# EasyEDA Pro project hall_effect_breakout_2025-11-21.epro

# Schematic Schematic1
Board Name: Board1; Create Date: 2025-10-31; Page Name: P1; Project Name: hall_effect_block_interface; Schematic Name: Schematic1; Update Date: 2025-11-03; Company: EasyEDA.com; Page Size: A4; Version: V1.0
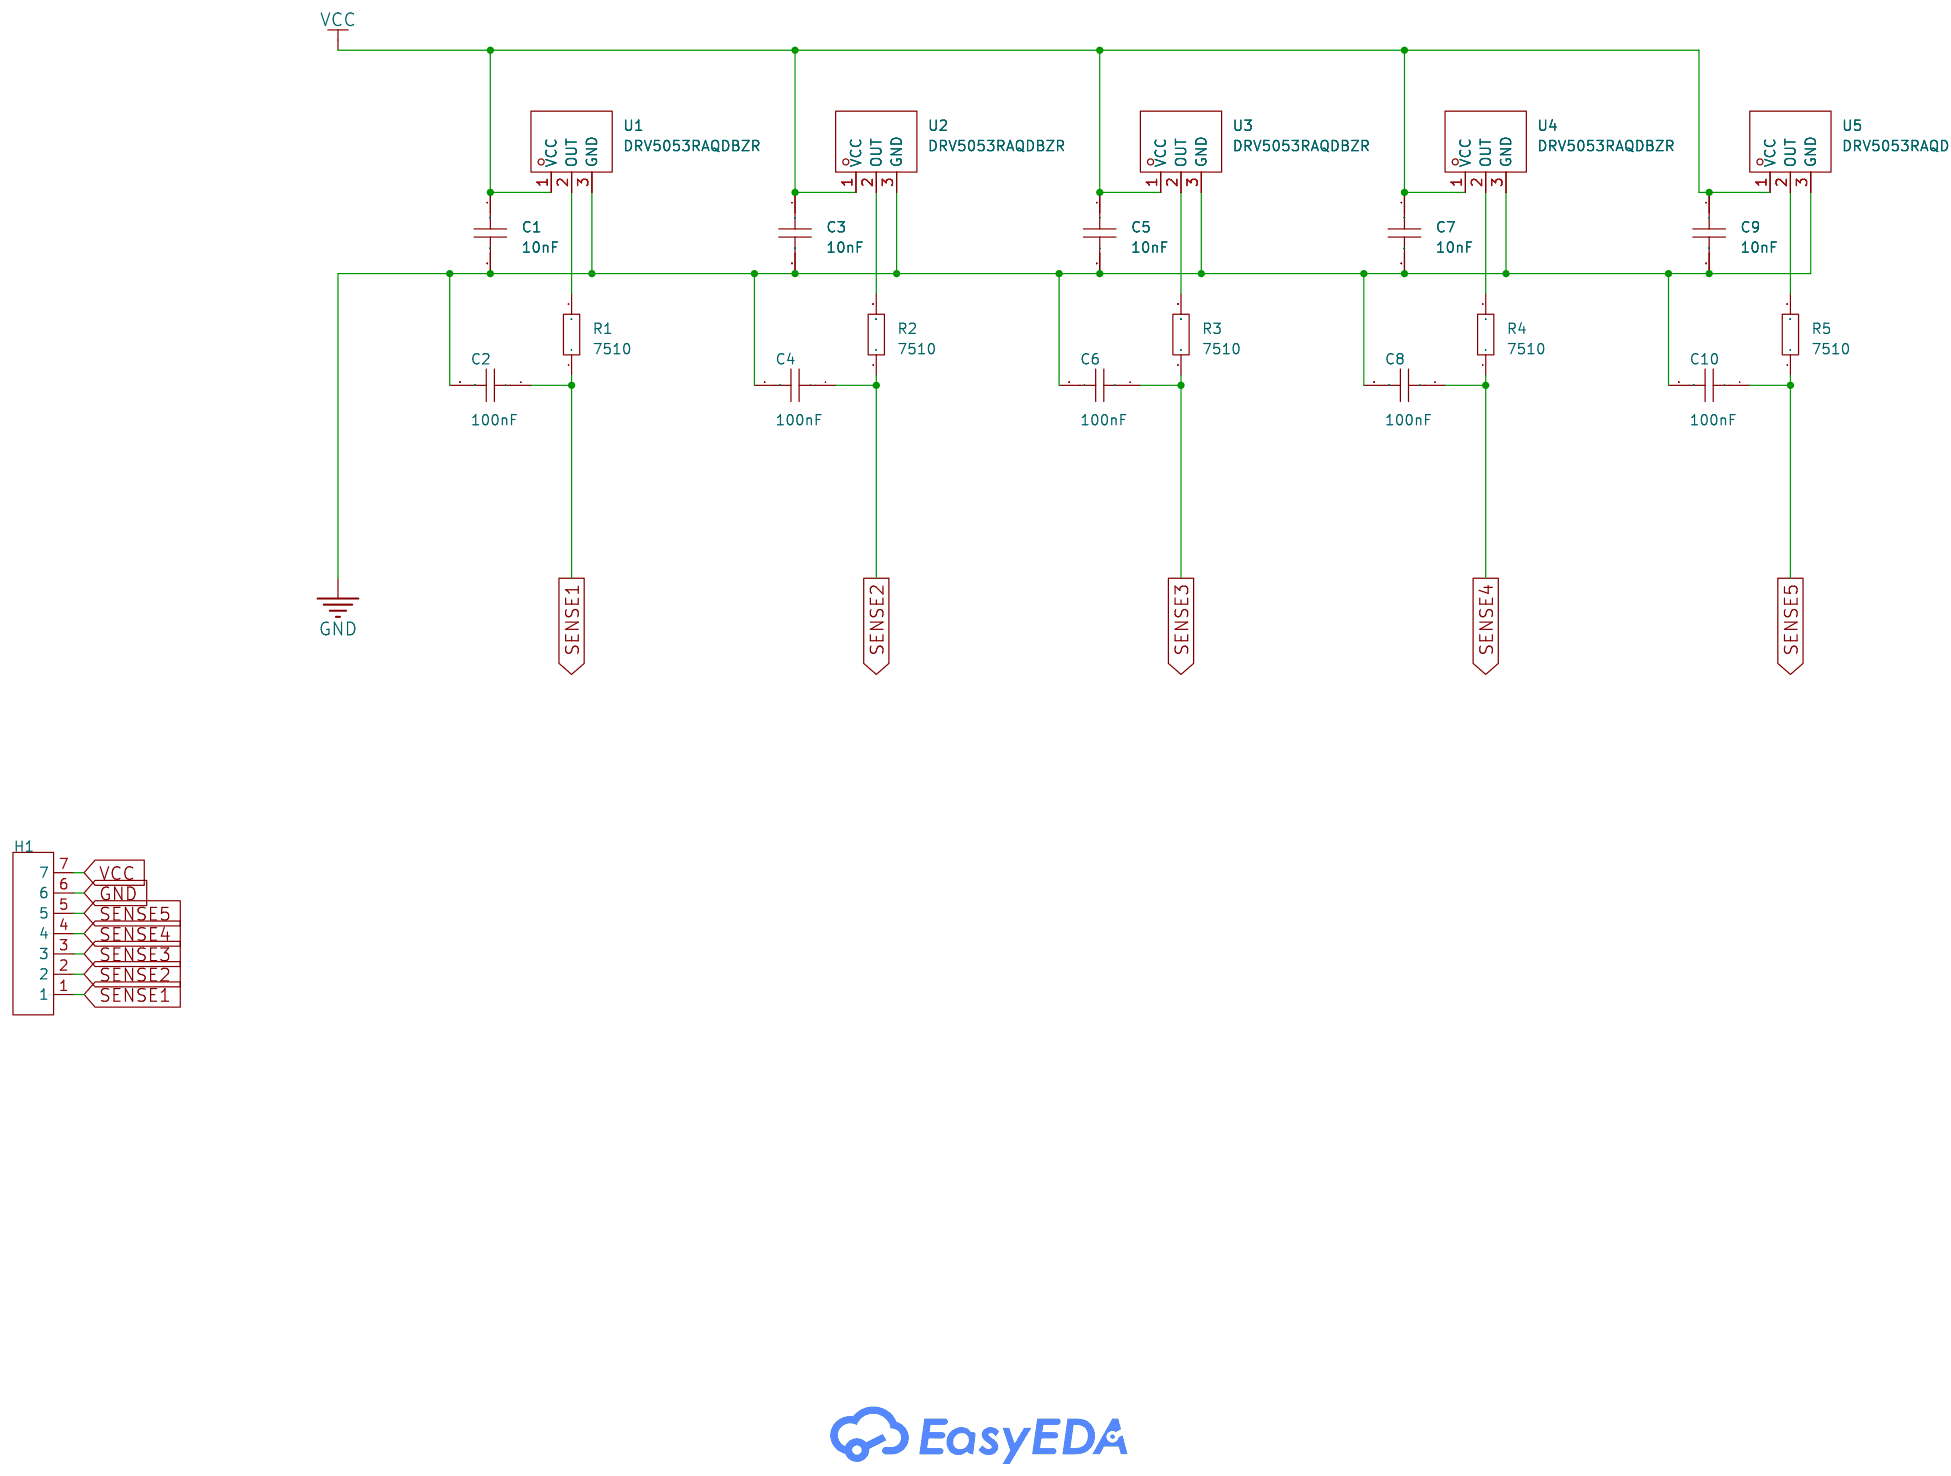
[diagram p0: schematic sheet]

## Parts
C1  10nF  [C0603]
C2  100nF  [C0603]
C3  10nF  [C0603]
C4  100nF  [C0603]
C5  10nF  [C0603]
C6  100nF  [C0603]
C7  10nF  [C0603]
C8  100nF  [C0603]
C9  10nF  [C0603]
C10  100nF  [C0603]
H1  PZ254V-11-07P  [HDR-TH_7P-P2.54-V-M]
R1  7510  [R0603]
R2  7510  [R0603]
R3  7510  [R0603]
R4  7510  [R0603]
R5  7510  [R0603]
U1  DRV5053RAQDBZR  [SOT-23-3_L2.9-W1.3-P0.95-LS2.4-BR]
U2  DRV5053RAQDBZR  [SOT-23-3_L2.9-W1.3-P0.95-LS2.4-BR]
U3  DRV5053RAQDBZR  [SOT-23-3_L2.9-W1.3-P0.95-LS2.4-BR]
U4  DRV5053RAQDBZR  [SOT-23-3_L2.9-W1.3-P0.95-LS2.4-BR]
U5  DRV5053RAQDBZR  [SOT-23-3_L2.9-W1.3-P0.95-LS2.4-BR]

## Library data of the parts
C1-C10 = CAP_0603: Supplier Footprint: 0603
H1 = PZ254V-11-07P: Pin Structure:1x7P Pitch:2.54mm Row Spacing:- Circluar Pins/Square Pins:Policy Mounting Type:Straight Number of Rows:Single Row Number of Pins:7P Current Rating:- Voltage Rating (Max):- Length of Mating Pin:6mm Insulation Height:2.5mm Length of End Connec; LCSC Part Name: 1x7P 间距:2.54mm 方针 直插; Supplier Part: C492406; Manufacturer: XFCN(兴飞); Supplier Footprint: 插件,P=2.54mm; JLCPCB Part Class: Extended Part; Datasheet: https://atta.szlcsc.com/upload/public/pdf/source/20200309/C492406_654C533EE691117E22DD9F76C114C2D9.pdf; Supplier: LCSC; Pin Structure: 1x7P; Pitch: 2.54mm; Circluar Pins/Square Pins: Policy; Mounting Type: Straight; Number of Rows: Single Row; Number of Pins: 7P; Length of Mating Pin: 6mm; Insulation Height: 2.5mm; Length of End Connection Pin: 3mm; Contact Material: Brass; Operating Temperature: -40℃~+105℃; Color: Black
R1-R5 = Res_0603: Supplier Footprint: 0603
U1-U5 = DRV5053RAQDBZR: Type:Bipolar Voltage - Supply:2.5V~38V Voltage - Supply:2.5V~38V Output Current:300uA Operating Temperature:-40℃~+125℃ Operating Temperature:-40℃~+125℃ Operating Current:2.7mA Sample Frequency:20kHz; LCSC Part Name: 双极霍尔效应传感器; Supplier Part: C2654960; Manufacturer: TI(德州仪器); Supplier Footprint: SOT-23; JLCPCB Part Class: Extended Part; Datasheet: https://www.ti.com/cn/lit/gpn/drv5053; Supplier: LCSC; Type: Bipolar; Voltage - Supply: 2.5V~38V; Output Current: 300uA; Operating Temperature: -40℃~+125℃; Operating Current: 2.7mA; Sample Frequency: 20kHz

## Nets
GND: C1.2 C2.2 C3.2 C4.2 C5.2 C6.2 C7.2 C8.2 C9.2 C10.2 H1.6 U1.3(GND) U2.3(GND) U3.3(GND) U4.3(GND) U5.3(GND)
VCC: C1.1 C3.1 C5.1 C7.1 C9.1 H1.7 U1.1(VCC) U2.1(VCC) U3.1(VCC) U4.1(VCC) U5.1(VCC)
SENSE1: C2.1 H1.1 R1.1
SENSE2: C4.1 H1.2 R2.1
SENSE3: C6.1 H1.3 R3.1
SENSE4: C8.1 H1.4 R4.1
SENSE5: C10.1 H1.5 R5.1
$1N1911: R1.2 U1.2(OUT)
$1N2092: R2.2 U2.2(OUT)
$1N2255: R3.2 U3.2(OUT)
$1N2426: R4.2 U4.2(OUT)
$1N2605: R5.2 U5.2(OUT)

# Board PCB1
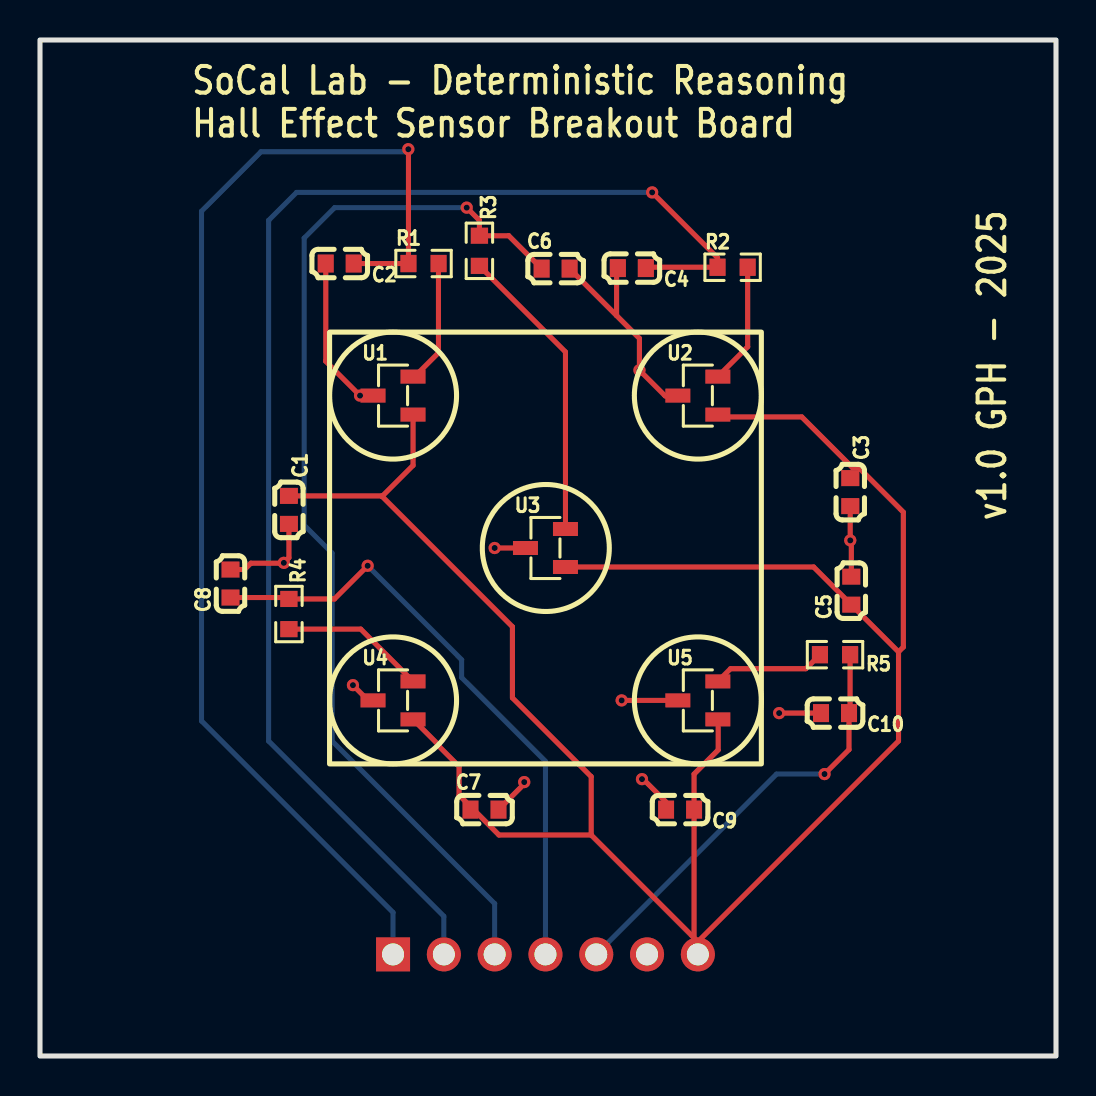
[diagram p1: board, top side]
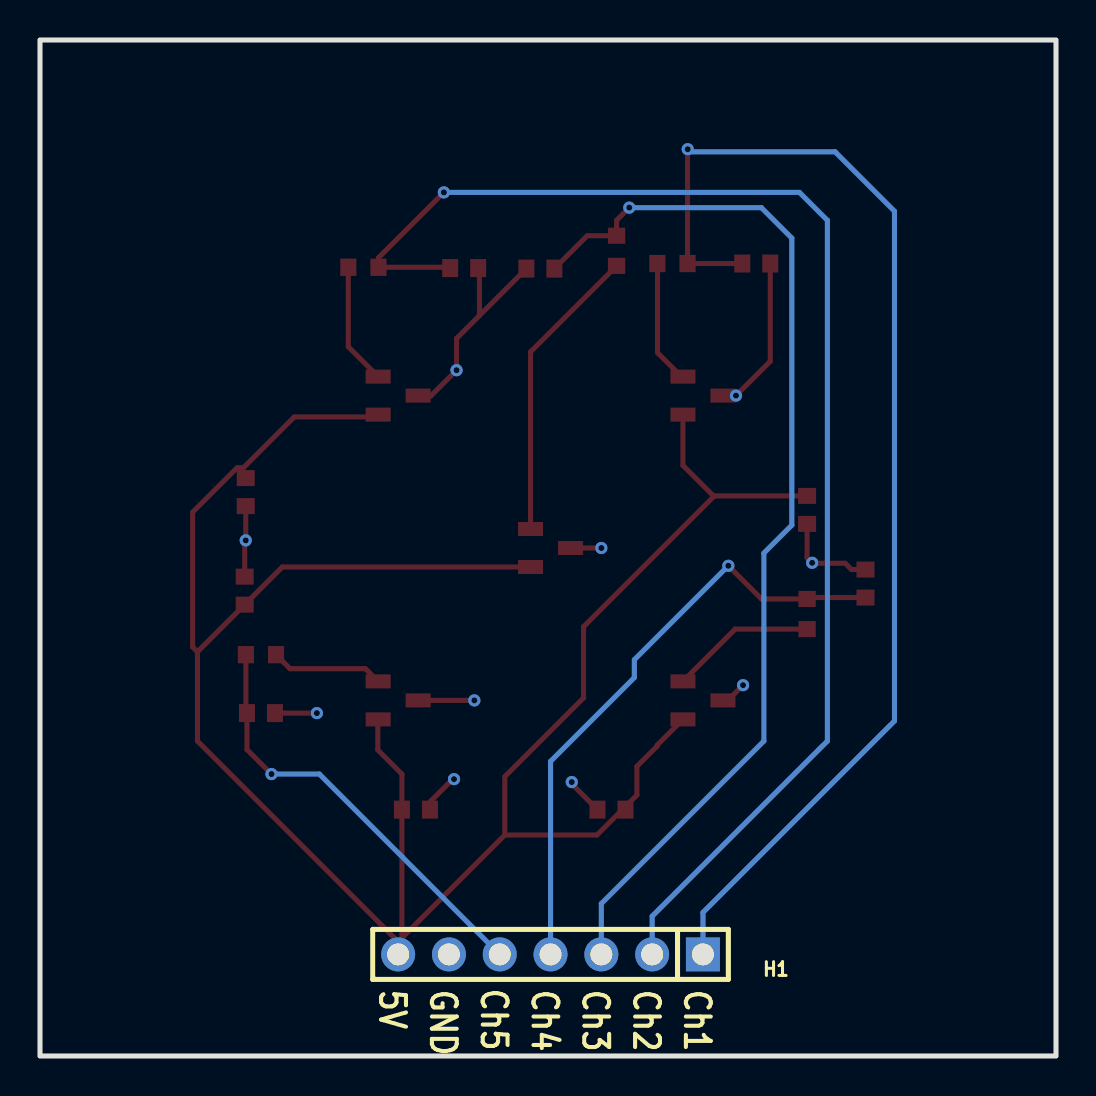
[diagram p2: board, bottom side, seen from below]

Outline 50.8 x 50.8 mm; copper layers: Top Layer, Inner1, Inner2, Bottom Layer. Coordinates in mm from the lower left corner of the outline.
Outline path: rectangle 0,50.8 50.8,0
Stack: Top Layer 0.035mm Outer layer thickness 1oz / Dielectric1 0.2104mm 7628 RC49% 8.6mil / Inner1 0.0152mm Inner layer thickness / Dielectric2 1.065mm 1.1mm H/HOZ Copper / Inner2 0.0152mm Inner layer thickness / Dielectric3 0.2104mm 7628 RC49% 8.6mil / Bottom Layer 0.035mm Outer layer thickness 1oz

## Design rules (mm)
template: JLCPCB Capability(Two Layers Board)
spacing copperThickness1oz (default): track to track 0.102, other pairs 0.152 to 0.3
spacing copperThickness2oz: track to track 0.203, other pairs 0.152 to 0.3
track width copperThickness1oz (default): min 0.127, default 0.254, max 2.54
track width copperThickness2oz: min 0.203, default 0.254, max 2.54
differential pair differentialPair (default): width min 0.127, default 0.254, max 2.54; gap min 0.152, default 0.152
via viaSize (default): diameter min 0.5, default 0.61, max 10; hole min 0.3, default 0.305, max 6.3

## Placement (name value [footprint] x y rotation side)
C1  10nF  [C0603]  12.45 27.31 270 top
C2  100nF  [C0603]  14.99 39.62 180 top
C3  10nF  [C0603]  40.51 28.19 270 top
C4  100nF  [C0603]  29.59 39.4 180 top
C5  10nF  [C0603]  40.57 23.27 90 top
C6  100nF  [C0603]  25.78 39.37 0 top
C7  10nF  [C0603]  22.23 12.32 0 top
C8  100nF  [C0603]  9.52 23.62 90 top
C9  10nF  [C0603]  32 12.32 180 top
C10  100nF  [C0603]  39.75 17.14 180 top
H1  PZ254V-11-07P  [HDR-TH_7P-P2.54-V-M]  25.27 5.08 0 bottom
R1  7510  [R0603]  19.18 39.62 0 top
R2  7510  [R0603]  34.63 39.44 0 top
R3  7510  [R0603]  21.97 40.26 270 top
R4  7510  [R0603]  12.45 22.1 270 top
R5  7510  [R0603]  39.75 20.07 180 top
U1  DRV5053RAQDBZR  [SOT-23-3_L2.9-W1.3-P0.95-LS2.4-BR]  17.65 33.02 0 top
U2  DRV5053RAQDBZR  [SOT-23-3_L2.9-W1.3-P0.95-LS2.4-BR]  32.89 33.02 0 top
U3  DRV5053RAQDBZR  [SOT-23-3_L2.9-W1.3-P0.95-LS2.4-BR]  25.27 25.4 0 top
U4  DRV5053RAQDBZR  [SOT-23-3_L2.9-W1.3-P0.95-LS2.4-BR]  17.65 17.78 0 top
U5  DRV5053RAQDBZR  [SOT-23-3_L2.9-W1.3-P0.95-LS2.4-BR]  32.89 17.78 0 top

## Footprints (pads in the part's own frame, mm; a bottom-side part is the same pattern mirrored in y, then rotated)
C0603
  rect 0.8x0.9 smd: 1(-0.7,0) 2(0.7,0)
HDR-TH_7P-P2.54-V-M
  rect 1.7x1.7 hole 1.1: 1(-7.62,0)
  round 1.7 hole 1.1: 2(-5.08,0) 3(-2.54,0) 4(0,0) 5(2.54,0) 6(5.08,0) 7(7.62,0)
R0603
  rect 0.806x0.864 smd: 1(-0.753,0) 2(0.753,0)
SOT-23-3_L2.9-W1.3-P0.95-LS2.4-BR
  rect 1.25x0.7 smd: 1(1,-0.95) 2(1,0.95) 3(-1,0)

## Nets
As in the schematic.

## Via types
v1: diameter 0.61, hole 0.305, Top Layer to Bottom Layer, 15 vias

## Routing (per net, layer and track width the routed paths; a pad name or vN(x,y) marks a point on that pad's centre or on a via; arc(x,y) is an arc through that point)
GND: length 39.2
  Top Layer w0.254: U2.3 31.88,33 31.26,33 v1(29.97,34.29) 29.97,35.88 28.83,37.02 ; U4.3 16.41,17.78 v1(15.65,18.54) ; C8.2 10.23,24.32 10.54,24.64 12.17,24.64 v1(12.19,24.66) 12.45,24.91 C1.2 ; v1(29.08,17.78) U5.3 ; 31.3,12.7 30.16,13.84 v1(30.1,13.84) ; U3.3 v1(22.73,25.4) ; C7.2 24.21,13.61 v1(24.21,13.7) ; C10.2 v1(36.96,17.14) ; U1.3 v1(16,33.02) 14.29,34.74 C2.2 ; v1(40.51,25.78) 40.57,25.73 C5.2 ; C6.2 28.83,37.02 ; 28.83,37.02 28.83,39.33 28.77,39.4 ; 40.39,27.49 40.51,27.37 40.51,25.78
VCC: length 117.5
  Top Layer w0.254: 42.93,20.21 C5.1 38.68,24.45 U3.1 ; 42.93,20.21 43.17,20.45 43.17,27.19 40.95,29.41 40.63,29.41 38.09,31.95 33.78,31.95 U2.1 ; 42.93,20.21 42.93,15.75 32.89,5.72 32.7,5.9 ; U4.1 19.94,15.54 19.94,15.49 20.95,14.48 20.95,13.04 22.95,11.05 27.56,11.05 ; 17.1,27.98 17.08,28 12.45,28 ; 17.1,27.98 23.62,21.46 23.62,17.91 27.56,13.97 27.56,11.05 ; 17.1,27.98 18.65,29.53 U1.1 ; 32.7,5.9 27.56,11.05 ; 32.7,5.9 32.7,14.1 33.91,15.3 33.91,16.81 U5.1
SENSE1: length 61.2
  Top Layer w0.254: C2.1 R1.1 18.42,45.33 v1(18.42,45.34)
  Bottom Layer w0.254: H1.1 17.65,7.17 8.08,16.75 8.08,42.24 11.05,45.21 18.29,45.21 v1(18.42,45.34)
SENSE2: length 69.4
  Top Layer w0.254: v1(30.61,43.18) 33.88,39.91 R2.1 30.21,39.44 30.17,39.4
  Bottom Layer w0.254: 19.75,5.08 H1.2 20.19,6.98 11.43,15.75 11.43,41.78 12.83,43.18 v1(30.61,43.18)
SENSE3: length 54
  Top Layer w0.254: C6.1 23.44,41.01 R3.1 21.97,41.78 v1(21.34,42.42)
  Bottom Layer w0.254: H1.3 22.73,7.62 14.61,15.75 14.61,25.15 13.21,26.54 13.21,40.89 14.73,42.42 v1(21.34,42.42)
SENSE4: length 30.7
  Top Layer w0.254: v1(16.38,24.51) 14.72,22.85 R4.1 12.38,22.92 C8.1
  Bottom Layer w0.254: v1(16.38,24.51) 21.08,19.81 21.08,18.92 25.27,14.73 H1.4
SENSE5: length 21.6
  Top Layer w0.254: v1(39.23,14.1) 40.45,15.32 C10.1 40.5,17.2 R5.1
  Bottom Layer w0.254: v1(39.23,14.1) 36.83,14.1 H1.5
$1N1911: length 6.2
  Top Layer w0.254: R1.2 19.92,39.62 19.92,35.16 18.73,33.97 U1.2
$1N2092: length 6.1
  Top Layer w0.254: R2.2 35.38,35.46 U2.2
$1N2255: length 14.9
  Top Layer w0.254: R3.2 26.27,35.2 U3.2
$1N2426: length 7.3
  Top Layer w0.254: U4.2 16.04,21.34 R4.2
$1N2605: length 5.7
  Top Layer w0.254: U5.2 34.53,19.36 38.3,19.36 R5.2

## Copper pours and planes (outline as drawn; the poured copper is in the pictures)
GND on Inner1: 0.26,50.54 50.54,50.54 50.54,0.26 0.26,0.26
GND on Inner2: 0.26,50.54 50.54,50.54 50.54,0.26 0.26,0.26

Small or netless copper shapes (teardrops, artwork), in the pictures only: 4 on Inner1, 4 on Inner2

## Text on the board
Bottom Silkscreen Layer: Ch1 | Ch2 | Ch3 | Ch4 | Ch5 | GND | 5V
Top Silkscreen Layer: SoCal Lab - Deterministic Reasoning / Hall Effect Sensor Breakout Board | v1.0 GPH - 2025
